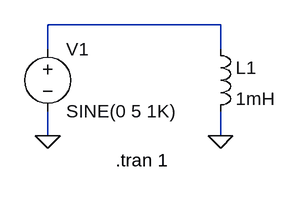
[diagram p0: schematic Bobina2.asc]
Bobina2.asc, the LTspice schematic file:
Version 4
SHEET 1 880 680
WIRE 320 112 96 112
WIRE 96 144 96 112
WIRE 320 144 320 112
WIRE 96 256 96 224
WIRE 320 256 320 224
FLAG 96 256 0
FLAG 320 256 0
SYMBOL voltage 96 128 R0
WINDOW 123 0 0 Left 0
WINDOW 39 0 0 Left 0
SYMATTR InstName V1
SYMATTR Value SINE(0 5 1K)
SYMBOL ind 304 128 R0
SYMATTR InstName L1
SYMATTR Value 1mH
TEXT 184 288 Left 2 !.tran 1

The netlist it stands for:
* Bobina2.asc
V1 N001 0 SINE(0 5 1K)
L1 N001 0 1mH
.tran 1
.backanno
.end